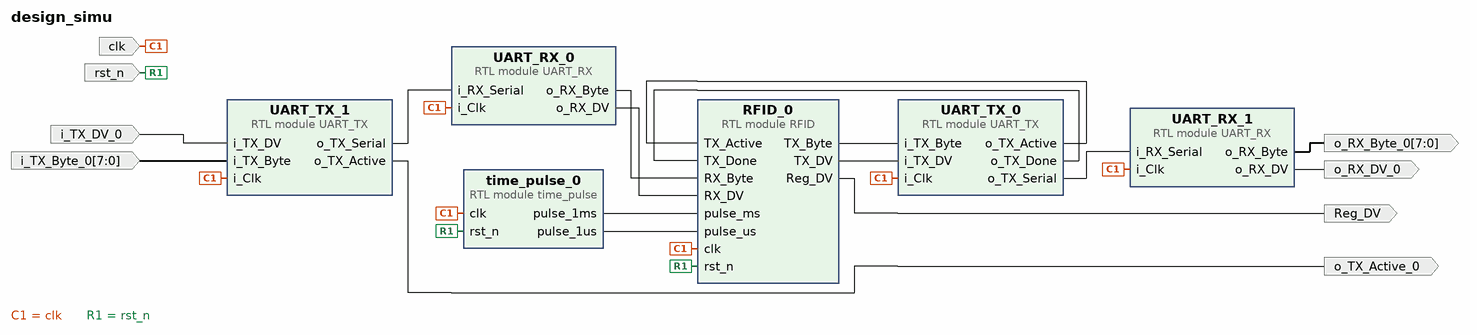
[diagram p0: block diagram of the top level]
# Vivado block design design_simu, xc7z020clg400-1, Vivado 2020.2
create_bd_design design_simu

create_bd_port -dir O Reg_DV
create_bd_port -dir I -type clk clk
create_bd_port -dir I -type rst rst_n
create_bd_port -dir I i_TX_DV_0
create_bd_port -dir I -from 7 -to 0 i_TX_Byte_0
create_bd_port -dir O o_TX_Active_0
create_bd_port -dir O o_RX_DV_0
create_bd_port -dir O -from 7 -to 0 o_RX_Byte_0

create_bd_cell -type module -reference time_pulse time_pulse_0
set_property -dict {CONFIG.freq_clk_MHz 50} [get_bd_cells time_pulse_0]
create_bd_cell -type module -reference UART_RX UART_RX_0
create_bd_cell -type module -reference UART_RX UART_RX_1
create_bd_cell -type module -reference UART_TX UART_TX_0
create_bd_cell -type module -reference UART_TX UART_TX_1
create_bd_cell -type module -reference RFID RFID_0

# ---- connections ----

connect_bd_net [get_bd_pins RFID_0/Reg_DV] [get_bd_ports Reg_DV]
connect_bd_net [get_bd_pins RFID_0/TX_Byte] [get_bd_pins UART_TX_0/i_TX_Byte]
connect_bd_net [get_bd_pins RFID_0/TX_DV] [get_bd_pins UART_TX_0/i_TX_DV]
connect_bd_net [get_bd_pins UART_RX_0/o_RX_Byte] [get_bd_pins RFID_0/RX_Byte]
connect_bd_net [get_bd_pins UART_RX_0/o_RX_DV] [get_bd_pins RFID_0/RX_DV]
connect_bd_net [get_bd_pins UART_TX_0/o_TX_Active] [get_bd_pins RFID_0/TX_Active]
connect_bd_net [get_bd_pins UART_TX_0/o_TX_Done] [get_bd_pins RFID_0/TX_Done]
connect_bd_net -net clk_wiz_0_clk_out1 [get_bd_ports clk] \
  [get_bd_pins time_pulse_0/clk] [get_bd_pins UART_RX_0/i_Clk] [get_bd_pins UART_RX_1/i_Clk] [get_bd_pins UART_TX_0/i_Clk] \
  [get_bd_pins UART_TX_1/i_Clk] [get_bd_pins RFID_0/clk]
connect_bd_net -net rst_n_0_1 [get_bd_ports rst_n] [get_bd_pins time_pulse_0/rst_n] [get_bd_pins RFID_0/rst_n]
connect_bd_net [get_bd_pins time_pulse_0/pulse_1ms] [get_bd_pins RFID_0/pulse_ms]
connect_bd_net [get_bd_pins time_pulse_0/pulse_1us] [get_bd_pins RFID_0/pulse_us]
connect_bd_net [get_bd_pins UART_TX_1/o_TX_Serial] [get_bd_pins UART_RX_0/i_RX_Serial]
connect_bd_net -net i_TX_DV_0_1 [get_bd_ports i_TX_DV_0] [get_bd_pins UART_TX_1/i_TX_DV]
connect_bd_net -net i_TX_Byte_0_1 [get_bd_ports i_TX_Byte_0] [get_bd_pins UART_TX_1/i_TX_Byte]
connect_bd_net [get_bd_pins UART_TX_1/o_TX_Active] [get_bd_ports o_TX_Active_0]
connect_bd_net [get_bd_pins UART_TX_0/o_TX_Serial] [get_bd_pins UART_RX_1/i_RX_Serial]
connect_bd_net [get_bd_pins UART_RX_1/o_RX_DV] [get_bd_ports o_RX_DV_0]
connect_bd_net [get_bd_pins UART_RX_1/o_RX_Byte] [get_bd_ports o_RX_Byte_0]

validate_bd_design
save_bd_design
